# EAGLE design gyro_adxr (EAGLE 6.1)
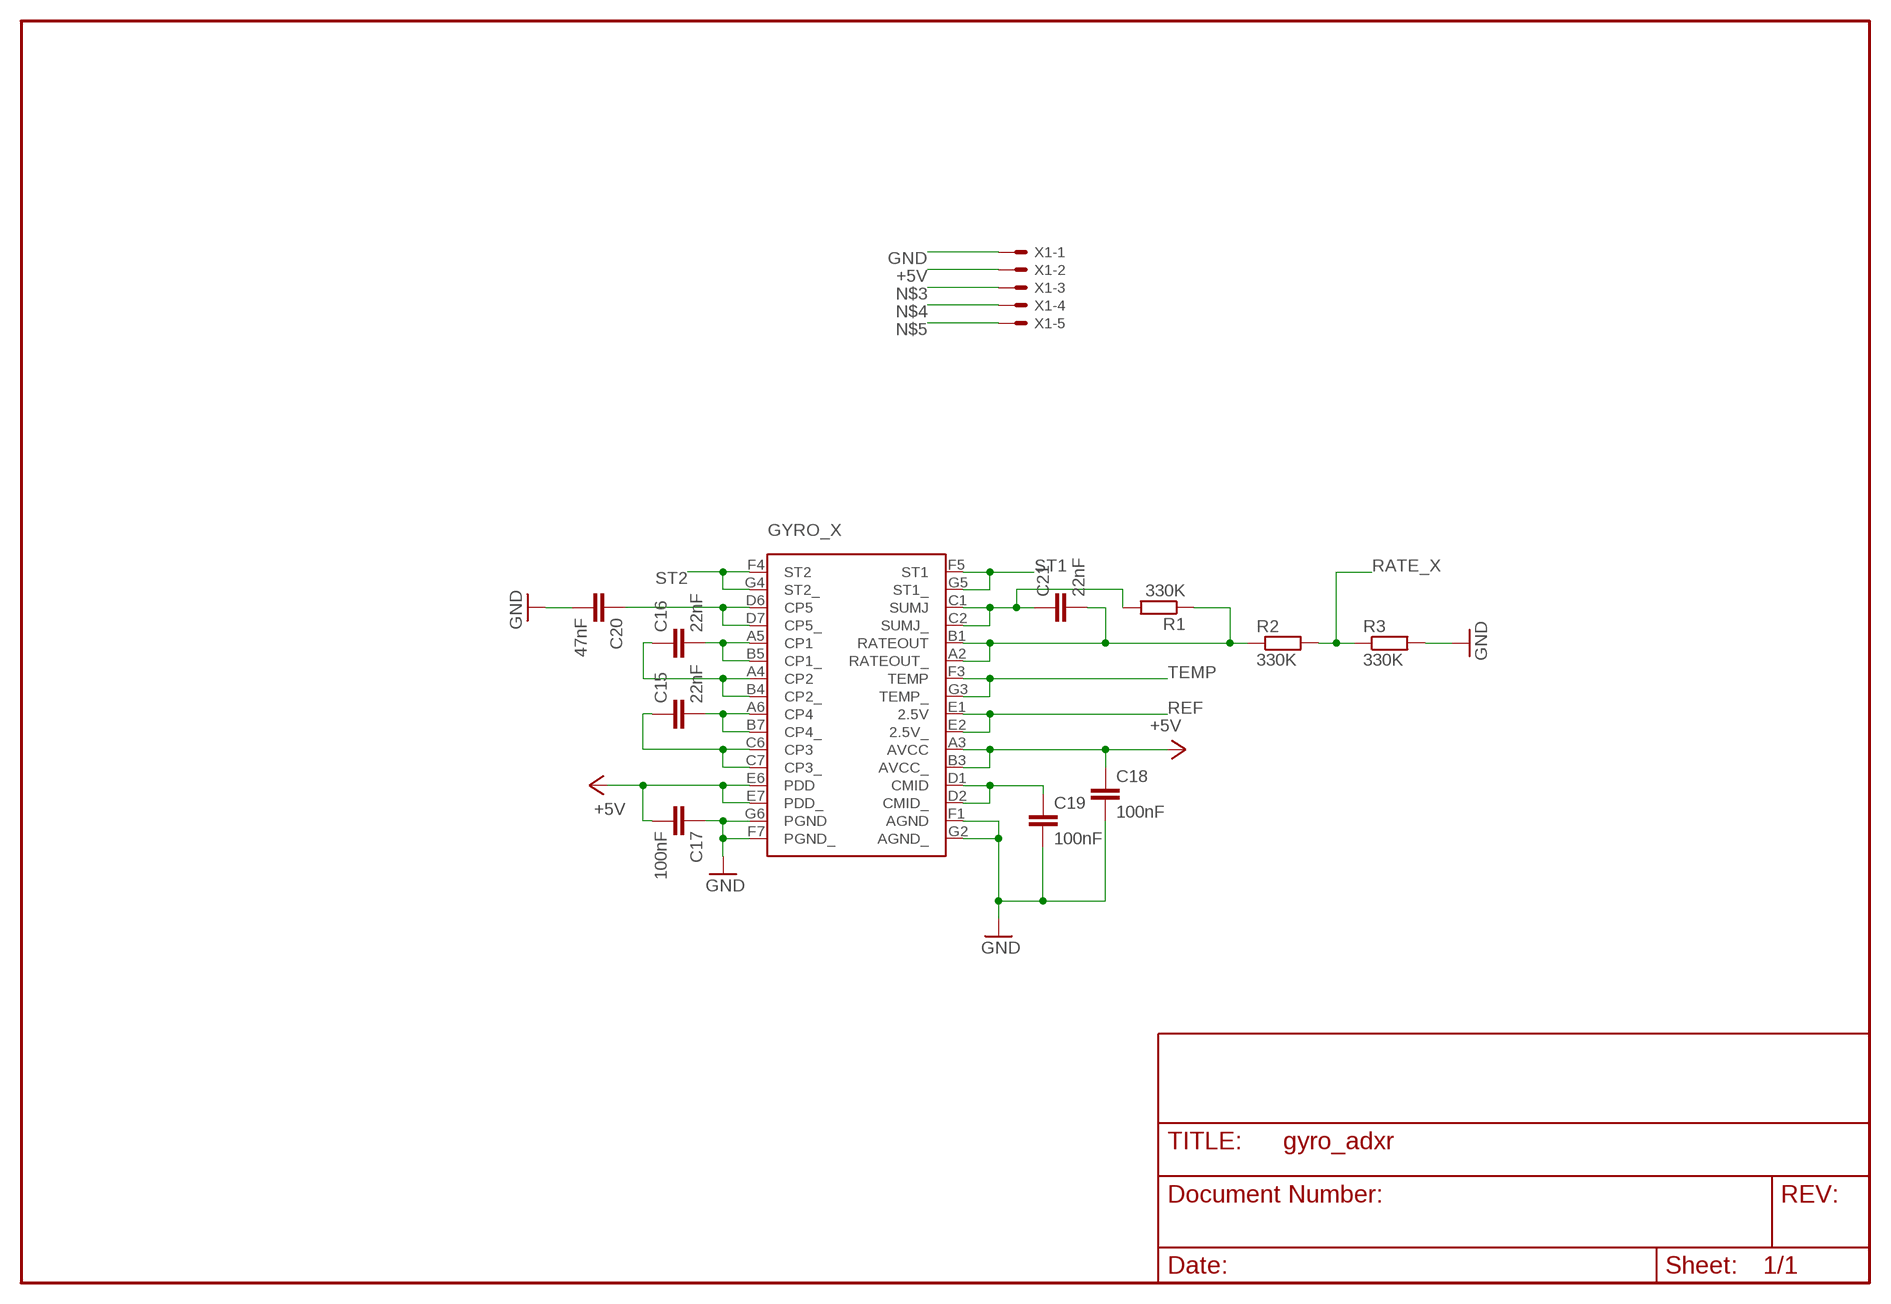
[diagram p0: schematic, sheet 1]

## Parts
C15  22nF  C-EUC0603K  [C0603K]
C16  22nF  C-EUC0603K  [C0603K]
C17  100nF  C-EUC0603K  [C0603K]
C18  100nF  C-EUC0603K  [C0603K]
C19  100nF  C-EUC0603K  [C0603K]
C20  47nF  C-EUC0603K  [C0603K]
C21  22nF  C-EUC0603K  [C0603K]
GYRO_X  ADXR  [BC-32]
R1  330K  R-EU_R0603  [R0603]
R2  330K  R-EU_R0603  [R0603]
R3  330K  R-EU_R0603  [R0603]
X1  53047-05  [53047-05]

## Nets
+5V: C17.2 C18.1 GYRO_X.A3(AVCC) GYRO_X.B3(AVCC_) GYRO_X.E6(PDD) GYRO_X.E7(PDD_) X1.2
GND: C17.1 C18.2 C19.2 C20.2 GYRO_X.F1(AGND) GYRO_X.F7(PGND_) GYRO_X.G2(AGND_) GYRO_X.G6(PGND) R3.2 X1.1
N$3: X1.3
N$4: X1.4
N$5: X1.5
N$6: C21.1 GYRO_X.C1(SUMJ) GYRO_X.C2(SUMJ_) R1.2
N$7: C15.1 GYRO_X.C6(CP3) GYRO_X.C7(CP3_)
N$11: C20.1 GYRO_X.D6(CP5) GYRO_X.D7(CP5_)
N$12: C16.2 GYRO_X.A5(CP1) GYRO_X.B5(CP1_)
N$13: C16.1 GYRO_X.A4(CP2) GYRO_X.B4(CP2_)
N$14: C15.2 GYRO_X.A6(CP4) GYRO_X.B7(CP4_)
N$19: C19.1 GYRO_X.D1(CMID) GYRO_X.D2(CMID_)
RATE_5V: C21.2 GYRO_X.A2(RATEOUT_) GYRO_X.B1(RATEOUT) R1.1 R2.1
RATE_X: R2.2 R3.1
REF: GYRO_X.E1(2.5V) GYRO_X.E2(2.5V_)
ST1: GYRO_X.F5(ST1) GYRO_X.G5(ST1_)
ST2: GYRO_X.F4(ST2) GYRO_X.G4(ST2_)
TEMP: GYRO_X.F3(TEMP) GYRO_X.G3(TEMP_)

## Library data of the parts
C15-C21 = rcl:C-EU: CAPACITOR, European symbol
GYRO_X = paparazzi:ADXR
R1-R3 = rcl:R-EU_: RESISTOR, European symbol
X1 = con-molex:53?-05: CONNECTOR wire to board 1.25 mm (.049 inch) pitch header

## Board
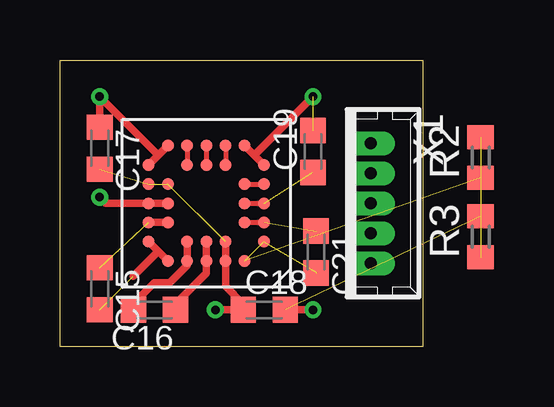
[diagram p1: board, top side]
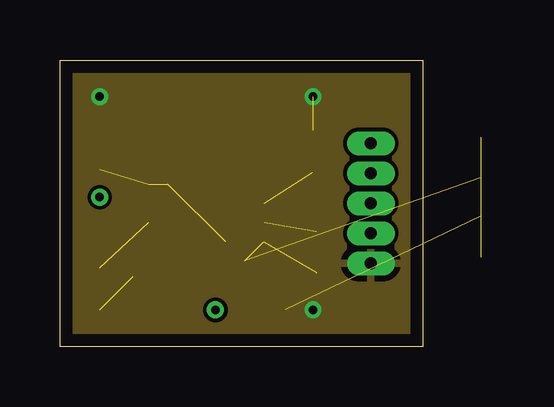
[diagram p2: board, inner layer Route2]
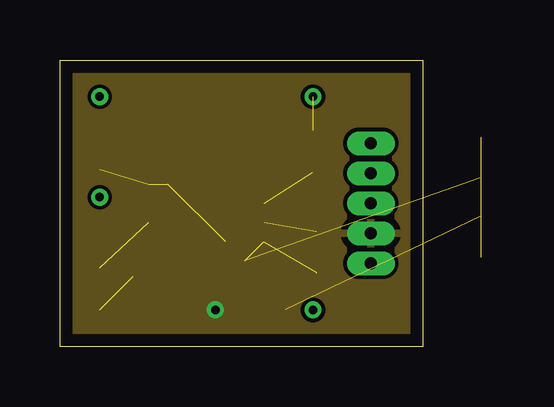
[diagram p3: board, inner layer Route15]
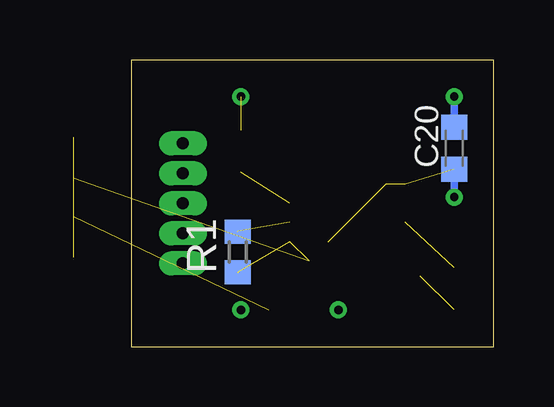
[diagram p4: board, bottom side, seen from below]

Size 15.11 x 11.94 mm. Coordinates in mm from the lower left corner, seen from the top.
Outline: 0,0 0,11.94 15.11,11.94 15.11,0 0,0
Copper layers (1*2+15*16): Top 0.035mm / dielectric 0.2mm / Route2 0.035mm / dielectric 1.5mm / Route15 0.035mm / dielectric 0.2mm / Bottom 0.035mm
Design rules: minimum track width 0.15mm, minimum drill 0.35mm, track to track 0.15mm, track to pad 0.15mm, pad to pad 0.15mm, via to via 0.15mm, smd to smd 0.15mm, copper to edge 20mil, drill to drill 8mil, minimum pad ring 10mil, minimum via ring 7mil, stop-mask expansion 4mil, vias tented up to drill 0mil, thermal gap 10mil

### Footprints (pad centres in the part's own frame; a part is rotated, then mirrored left to right if it is on the bottom)
C0603K = smd 1.05 x 1.08: 1 -0.875,0; 2 0.875,0
BC-32 = smd 0.5 x 0.5: A2 -1.6,2.4; A3 -0.8,2.4; A4 0,2.4; A5 0.8,2.4; A6 1.6,2.4; B1 -2.4,1.6; B3 -0.8,1.6; B4 0,1.6; B5 0.8,1.6; B7 2.4,1.6; C1 -2.4,0.8; C2 -1.6,0.8; C6 1.6,0.8; C7 2.4,0.8; D1 -2.4,0; D2 -1.6,0; D6 1.6,0; D7 2.4,0; E1 -2.4,-0.8; E2 -1.6,-0.8; E6 1.6,-0.8; E7 2.4,-0.8; F1 -2.4,-1.6; F3 -0.8,-1.6; F4 0,-1.6; F5 0.8,-1.6; F7 2.4,-1.6; G2 -1.6,-2.4; G3 -0.8,-2.4; G4 0,-2.4; G5 0.8,-2.4; G6 1.6,-2.4
R0603 = smd 1 x 1.1: 1 -0.85,0; 2 0.85,0
53047-05 = drill 0.5 pad 0.698 long: 1 2.5,0; 2 1.25,0; 3 0,0; 4 -1.25,0; 5 -2.5,0

### Placement (x,y rotation side)
C15  1.65,2.41 270 top
C16  3.94,1.52 180 top
C17  1.65,8.25 270 top
C18  8.51,1.52 0 top
C19  10.54,8.13 90 top
C20  1.65,8.25 90 bottom
C21  10.67,3.94 270 top
GYRO_X  6.1,5.97 180 top
R1  10.67,3.94 90 bottom
R2  17.53,7.87 90 top
R3  17.53,4.57 90 top
X1  12.95,5.97 270 top

### Tracks (layer width: path | path; a pad name or v marks a point on that pad's centre or on a via)
+5V  (via drill 0.35)  (3 unrouted)
  Top 0.305: 6.87,3.57 6.86,3.56 | 6.87,3.57 GYRO_X.A3 6.9,2.5 7.62,1.78 7.62,1.52 | GYRO_X.B3 6.9,3.59 6.87,3.57 | v6.48,1.52 7.62,1.52 | 7.62,1.52 C18.1
  pour Route15: 14.73,11.68 0.25,11.68 0.25,0.25 14.73,0.25
GND  (via drill 0.35)  (2 unrouted)
  Top 0.203: GYRO_X.F1 8.51,7.58 8.51,7.62 8.45,7.62
  Top 0.305: GYRO_X.G2 8.1,7.97 | 8.1,7.97 8.45,7.62 | GYRO_X.F7 3.68,7.58 3.68,7.62 3.75,7.62 4.1,7.97 | 4.1,7.97 GYRO_X.G6 | 4.1,7.97 v1.65,10.41 C20.2 | 8.1,7.97 v10.54,10.41 | C18.2 v10.54,1.52
  Bottom 0.305: C20.2 v1.65,10.41
  pour Route2: 14.86,11.68 0.25,11.68 0.25,0.25 14.86,0.25
N$6  (2 unrouted)
  Top 0.203: GYRO_X.C2 GYRO_X.C1 8.51,5.17 8.51,5.21
N$7  (1 unrouted)
  Top 0.254: GYRO_X.C6 4.48,5.17 4.45,5.21 4.41,5.17
  Top 0.305: GYRO_X.C7 4.41,5.17
N$11  (via drill 0.35)
  Top 0.305: v1.65,6.22 1.9,5.97 GYRO_X.D7 GYRO_X.D6
  Bottom 0.305: v1.65,6.22 C20.1
N$12
  Top 0.305: 5.32,3.57 5.33,3.56 | 5.32,3.57 GYRO_X.A5 5.3,3.39 4.57,2.67 3.94,2.67 3.05,1.78 3.06,1.76 C16.2 | GYRO_X.B5 5.3,3.59 5.32,3.57
N$13
  Top 0.305: GYRO_X.B4 GYRO_X.A4 6.1,3.05 4.81,1.76 C16.1
N$14  (1 unrouted)
  Top 0.254: GYRO_X.A6 4.48,3.56 4.45,3.56 4.45,3.62
  Top 0.305: GYRO_X.B7 4.1,3.97 | 4.1,3.97 4.45,3.62 | 4.1,3.97 3.06,2.93
N$19  (1 unrouted)
  Top 0.203: 8.51,5.97 GYRO_X.D1 GYRO_X.D2
RATE_5V  (4 unrouted)
RATE_X  (1 unrouted)
REF
  Top 0.203: GYRO_X.E2 7.66,6.77 | 7.66,6.77 GYRO_X.E1 | 7.66,6.77 7.62,6.73
ST1
  Top 0.203: 5.32,8.37 5.33,8.38 | GYRO_X.G5 5.32,8.37 | GYRO_X.F5 5.3,8.34 5.32,8.37
ST2
  Top 0.203: 6.1,8.38 GYRO_X.G4 GYRO_X.F4
TEMP
  Top 0.203: 6.87,8.37 6.86,8.38 | GYRO_X.G3 6.87,8.37 | GYRO_X.F3 6.9,8.34 6.87,8.37